# Altium project SR4K_PHY6222_v1.PrjPcb
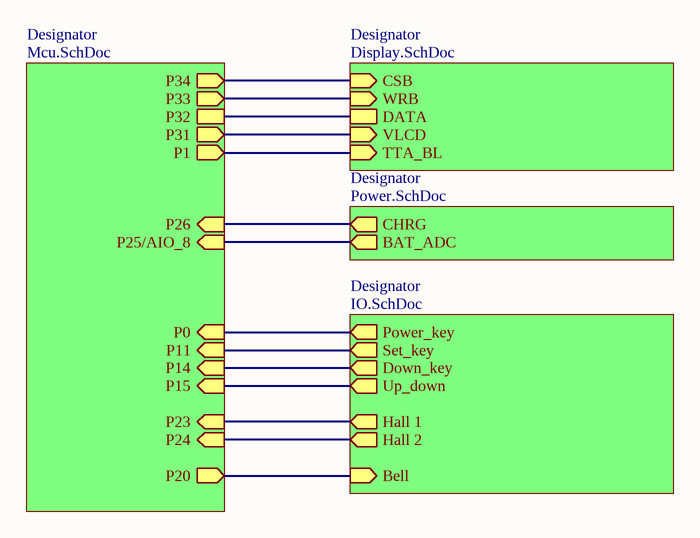
[diagram p0: Main.SchDoc]
5 sheets, 62 parts. Net scope: hierarchical (ports join the sheet entries above them; power ports are global).
Sheets:
  Main.SchDoc
    Designator = Display.SchDoc
    Designator = Power.SchDoc
    Designator = IO.SchDoc
    Designator = Mcu.SchDoc

## Sheet Main.SchDoc: SR4K_PHY6222
size A4; DrawnBy: emmovo@outlook.com; Revision: V1.2; SheetNumber: 1; SheetTotal: 5

### Sub-sheets
Designator = Display.SchDoc: CSB (in), WRB (in), DATA, VLCD (in), TTA_BL (in)
Designator = Power.SchDoc: CHRG (out), BAT_ADC (out)
Designator = IO.SchDoc: Power_key (out), Set_key (out), Down_key (out), Up_down (out), Hall 1 (out), Hall 2 (out), Bell (in)
Designator = Mcu.SchDoc: P34 (out), P33 (out), P32, P31 (out), P26 (in), P25/AIO_8 (in), P24 (in), P23 (in), P0 (in), P11 (in), P14 (in), P15 (in), P20 (out), P1 (out)

### Nets
BAT_ADC: sheet Designator/BAT_ADC, sheet Designator/P25/AIO_8
CHRG: sheet Designator/CHRG, sheet Designator/P26
NetC3_2: sheet Designator/Power_key, sheet Designator/P0
NetC4_2: sheet Designator/Set_key, sheet Designator/P11
NetC6_2: sheet Designator/Down_key, sheet Designator/P14
NetR2_2: sheet Designator/TTA_BL, sheet Designator/P1
NetR5_2: sheet Designator/Bell, sheet Designator/P20
NetTP1_0: sheet Designator/CSB, sheet Designator/P34
NetTP2_0: sheet Designator/WRB, sheet Designator/P33
NetTP3_0: sheet Designator/DATA, sheet Designator/P32
NetTP4_0: sheet Designator/VLCD, sheet Designator/P31
NetU1#2_3: sheet Designator/Hall 1, sheet Designator/P23
NetU2_3: sheet Designator/Hall 2, sheet Designator/P24
NetU3#2_15: sheet Designator/Up_down, sheet Designator/P15

### Notes on the sheet
- Title
- Size:
- Date:
- A4
- Number:
- Time:
- Revision:
- Sheet
- emmovo@outlook.com
- of
- File:

## Sheet Display.SchDoc: SR4K_PHY6222
size A4; Revision: V1.2; SheetNumber: 3; SheetTotal: 5
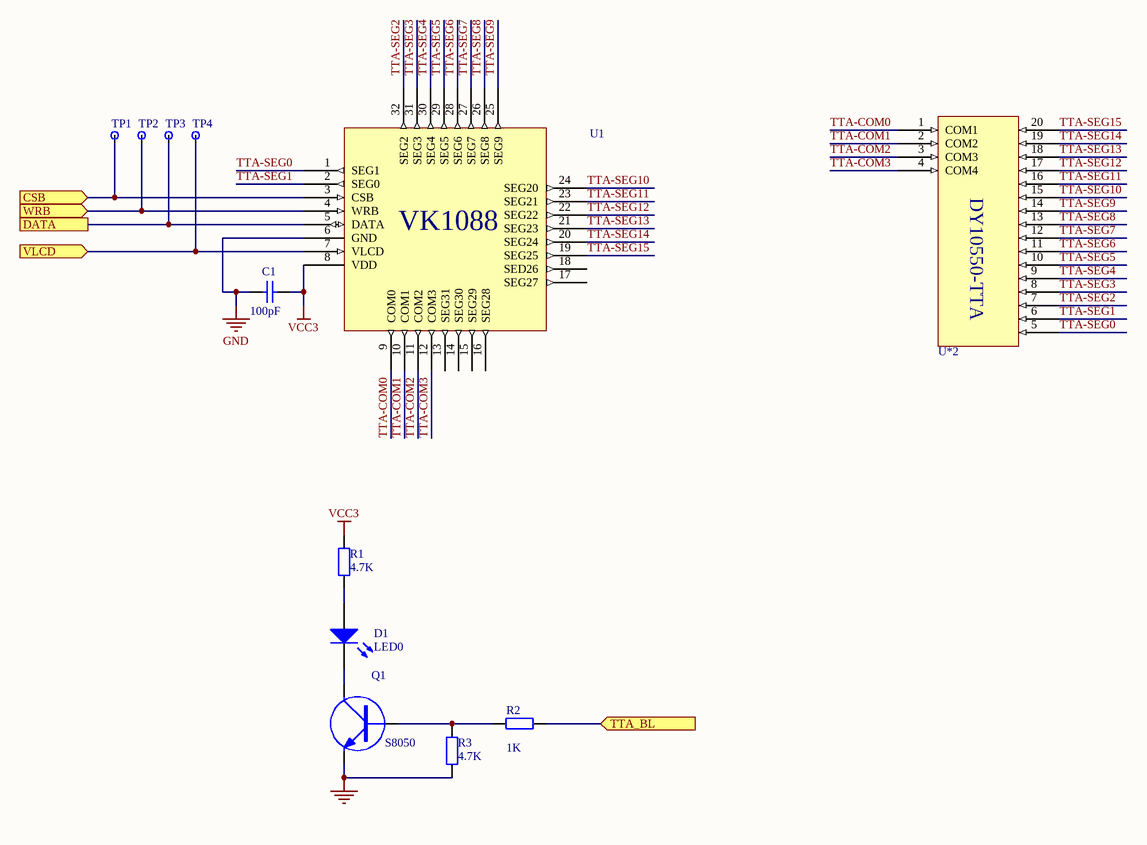
[diagram p1: Display.SchDoc]

### Parts
(Parts that share a designator on the sheet are numbered #1, #2 ... from top to bottom, then left to right.)
C1  value 100pF  [RAD-0.3]  (hidden comment: Cap)
D1  LED0
Q1  S8050
R1  value 4.7K  (hidden comment: Res2)
R2  value 1K  (hidden comment: Res2)
R3  value 4.7K  (hidden comment: 100K)
TP1  TP  (value not drawn)
TP2  TP  (value not drawn)
TP3  TP  (value not drawn)
TP4  TP  (value not drawn)
U1#1  U*  (value not drawn)
U*2  DY10550-TTA  (value not drawn)

### Ports
CSB (in), DATA, TTA_BL (in), VLCD (in), WRB (in)

### Nets
GND: C1.1 Q1.2(E) R3.1 U1#1.6(GND)
VCC3: C1.2 R1.2 U1#1.8(VDD)
TTA-COM0: U1#1.9(COM0) U*2.1(COM1)
TTA-COM1: U1#1.10(COM1) U*2.2(COM2)
TTA-COM2: U1#1.11(COM2) U*2.3(COM3)
TTA-COM3: U1#1.12(COM3) U*2.4(COM4)
TTA-SEG0: U1#1.1(SEG1) U*2.5
TTA-SEG1: U1#1.2(SEG0) U*2.6
TTA-SEG2: U1#1.32(SEG2) U*2.7
TTA-SEG3: U1#1.31(SEG3) U*2.8
TTA-SEG4: U1#1.30(SEG4) U*2.9
TTA-SEG5: U1#1.29(SEG5) U*2.10
TTA-SEG6: U1#1.28(SEG6) U*2.11
TTA-SEG7: U1#1.27(SEG7) U*2.12
TTA-SEG8: U1#1.26(SEG8) U*2.13
TTA-SEG9: U1#1.25(SEG9) U*2.14
TTA-SEG10: U1#1.24(SEG20) U*2.15
TTA-SEG11: U1#1.23(SEG21) U*2.16
TTA-SEG12: U1#1.22(SEG22) U*2.17
TTA-SEG13: U1#1.21(SEG23) U*2.18
TTA-SEG14: U1#1.20(SEG24) U*2.19
TTA-SEG15: U1#1.19(SEG25) U*2.20
NetD1_1: D1.1(A) R1.1
NetD1_2: D1.2(K) Q1.3(C)
NetQ1_1: Q1.1(B) R2.1 R3.2
NetR2_2: R2.2 ; port TTA_BL
NetTP1_0: TP1.0 U1#1.3(CSB) ; port CSB
NetTP2_0: TP2.0 U1#1.4(WRB) ; port WRB
NetTP3_0: TP3.0 U1#1.5(DATA) ; port DATA
NetTP4_0: TP4.0 U1#1.7(VLCD) ; port VLCD

Not connected (* = marked no-connect by the designer): U1#1 13(SEG31) 14(SEG30) 15(SEG29) 16(SEG28) 17(SEG27) 18(SED26)

### Notes on the sheet
- Title
- Size:
- Date:
- A4
- Number:
- Time:
- Revision:
- Sheet
- emmovo@outlook.com
- of
- File:

### Library data of the parts
C1 = Cap: Capacitor; Published: 8-Jun-2000; LatestRevisionDate: 17-Jul-2002; LatestRevisionNote: Re-released for DXP Platform.; PackageReference: RAD-0.3; Publisher: Altium Limited; PackageDescription: Radial Cap, Thru-Hole; 2 Leads; 0.3 in Pin Spacing
D1 = LED0: Typical INFRARED GaAs LED; Published: 8-Jun-2000; LatestRevisionDate: 08-Jul-2005; LatestRevisionNote: Mech Layer 1 removed.; PackageReference: LED-0; Publisher: Altium Limited; PackageDescription: LED; 2 Leads
Q1 = NPN: NPN Transistor
R1-R3 = Res2: Resistor; Published: 8-Jun-2000; LatestRevisionDate: 17-Jul-2002; LatestRevisionNote: Re-released for DXP Platform.; PackageReference: AXIAL-0.4; Publisher: Altium Limited; PackageDescription: Axial Device, Thru-Hole; 2 Leads; 0.4 in Pin Spacing
U1#1 = VK1088

## Sheet Power.SchDoc: SR4K_PHY6222
size A4; Revision: V1.2; SheetNumber: 4; SheetTotal: 5
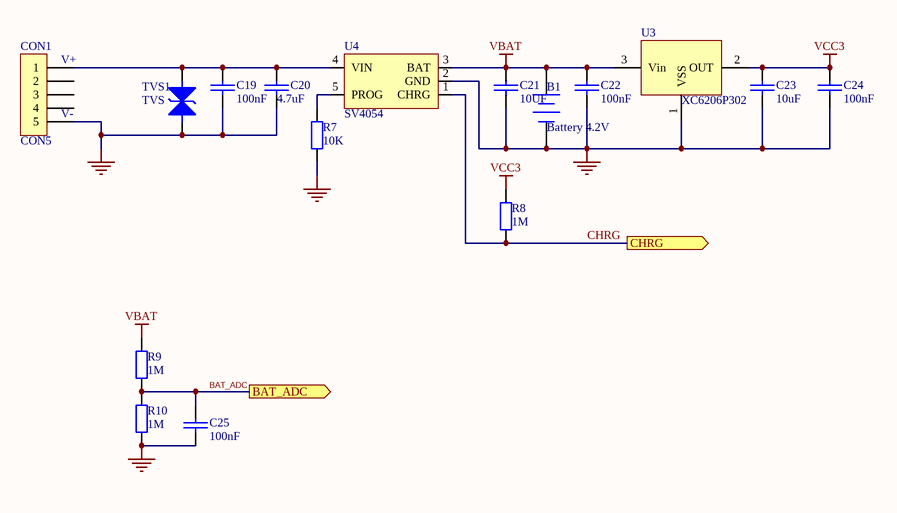
[diagram p2: Power.SchDoc]

### Parts
(Parts that share a designator on the sheet are numbered #1, #2 ... from top to bottom, then left to right.)
B1  Battery 4.2V  [JP2S]
C19  100nF  [0603]
C20  4.7uF  [0603]
C21  10UF  [0603]
C22  100nF  [0603]
C23  10uF  [0603]
C24  100nF  [0603]
C25  100nF
CON1  CON5
R7  10K  [AXIAL-0.4]
R8  1M
R9  1M
R10  1M
TVS1  TVS  [SOD-123]
U3#1  XC6206P302  [SOT-23]
U4  SV4054  [SOT-25]

### Ports
BAT_ADC (out), CHRG (out)

### Nets
GND: B1.2(-) C19.1 C20.1 C21.1 C22.1 C23.1 C24.1 C25.1 CON1.5 R7.1 R10.1 TVS1.1 U3#1.1(VSS) U4.2(GND)
VBAT: B1.1(+) C21.2 C22.2 R9.2 U3#1.3(Vin) U4.3(BAT)
VCC3: C23.2 C24.2 R8.2 U3#1.2(OUT)
BAT_ADC: C25.2 R9.1 R10.2 ; port BAT_ADC
CHRG: R8.1 U4.1(CHRG) ; port CHRG
NetC19_2: C19.2 C20.2 CON1.1 TVS1.2 U4.4(VIN)
NetR7_2: R7.2 U4.5(PROG)

Not connected (* = marked no-connect by the designer): CON1 2 3 4

### Notes on the sheet
- (near CON1) V+
- (near CON1) V-
- Title
- Size:
- Date:
- A4
- Number:
- Time:
- Revision:
- Sheet
- emmovo@outlook.com
- of
- File:

### Library data of the parts
B1 = Battery: Multicell Battery; Published: 24-Mar-1999; LatestRevisionDate: 17-Jul-2002; LatestRevisionNote: Re-released for DXP Platform.; PackageReference: BAT-2; Publisher: Altium Limited; PackageDescription: Battery; 2 Leads
C19-C25 = CAP: Capacitor
CON1 = CON5: Connector
R7 = Res2: 1%@100mA; Published: 8-Jun-2000; LatestRevisionDate: 17-Jul-2002; LatestRevisionNote: Re-released for DXP Platform.; PackageReference: AXIAL-0.4; Publisher: Altium Limited; PackageDescription: Axial Device, Thru-Hole; 2 Leads; 0.4 in Pin Spacing; Value: 10K
R8-R10 = Res2: Published: 8-Jun-2000; LatestRevisionDate: 17-Jul-2002; LatestRevisionNote: Re-released for DXP Platform.; PackageReference: AXIAL-0.4; Publisher: Altium Limited; PackageDescription: Axial Device, Thru-Hole; 2 Leads; 0.4 in Pin Spacing; Value: 1M

## Sheet IO.SchDoc: SR4K_PHY6222
size A4; Revision: V1.2; SheetNumber: 5; SheetTotal: 5
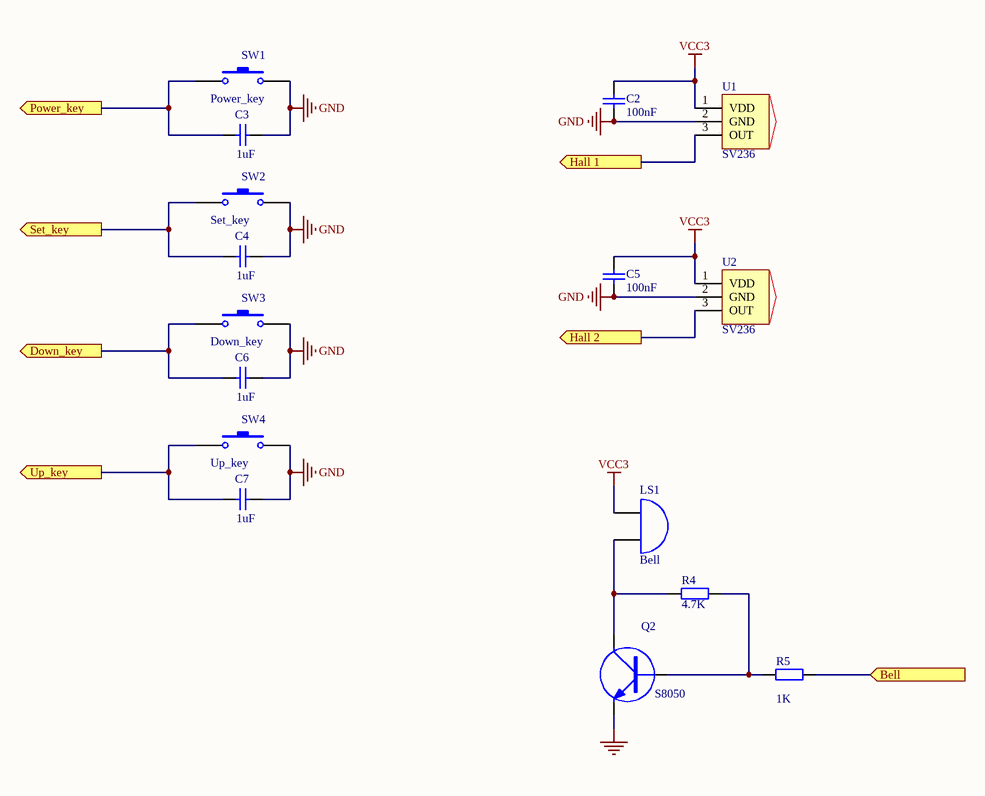
[diagram p3: IO.SchDoc]

### Parts
(Parts that share a designator on the sheet are numbered #1, #2 ... from top to bottom, then left to right.)
C2  value 100nF  [RAD-0.3]  (hidden comment: Cap)
C3  value 1uF  (hidden comment: Cap)
C4  value 1uF  (hidden comment: Cap)
C5  value 100nF  [RAD-0.3]  (hidden comment: Cap)
C6  value 1uF  (hidden comment: Cap)
C7  value 1uF  (hidden comment: Cap)
LS1  Bell
Q2  S8050  [SOT-23]
R4  value 4.7K  (hidden comment: 100K)
R5  value 1K  (hidden comment: Res2)
SW1  Power_key
SW2  Set_key
SW3  Down_key
SW4  Up_key
U1#2  SV236  [sot-23-3]
U2  SV236  [sot-23-3]

### Ports
Bell (in), Down_key (out), Hall 1 (out), Hall 2 (out), Power_key (out), Set_key (out), Up_key (out)

### Nets
GND: C2.2 C3.1 C4.1 C5.2 C6.1 C7.1 Q2.2(E) SW1.2 SW2.2 SW3.2 SW4.2 U1#2.2(GND) U2.2(GND)
VCC3: C2.1 C5.1 LS1.1(A) U1#2.1(VDD) U2.1(VDD)
NetC3_2: C3.2 SW1.1 ; port Power_key
NetC4_2: C4.2 SW2.1 ; port Set_key
NetC6_2: C6.2 SW3.1 ; port Down_key
NetC7_2: C7.2 SW4.1 ; port Up_key
NetLS1_2: LS1.2(B) Q2.3(C) R4.2
NetQ2_1: Q2.1(B) R4.1 R5.1
NetR5_2: R5.2 ; port Bell
NetU1#2_3: U1#2.3(OUT) ; port Hall 1
NetU2_3: U2.3(OUT) ; port Hall 2

### Notes on the sheet
- Title
- Size:
- Date:
- A4
- Number:
- Time:
- Revision:
- Sheet
- emmovo@outlook.com
- of
- File:

### Library data of the parts
C2-C7 = Cap: Capacitor; Published: 8-Jun-2000; LatestRevisionDate: 17-Jul-2002; LatestRevisionNote: Re-released for DXP Platform.; PackageReference: RAD-0.3; Publisher: Altium Limited; PackageDescription: Radial Cap, Thru-Hole; 2 Leads; 0.3 in Pin Spacing
LS1 = Bell: Electrical Bell; Published: 24-Mar-1999; LatestRevisionDate: 17-Jul-2002; LatestRevisionNote: Re-released for DXP Platform.; PackageReference: PIN2; Publisher: Altium Limited
Q2 = NPN: NPN Transistor
R4 R5 = Res2: Resistor; Published: 8-Jun-2000; LatestRevisionDate: 17-Jul-2002; LatestRevisionNote: Re-released for DXP Platform.; PackageReference: AXIAL-0.4; Publisher: Altium Limited; PackageDescription: Axial Device, Thru-Hole; 2 Leads; 0.4 in Pin Spacing
SW1-SW4 = SW-PB: Switch; Published: 24-Mar-1999; LatestRevisionDate: 17-Jul-2002; LatestRevisionNote: Re-released for DXP Platform.; PackageReference: SPST-2; Publisher: Altium Limited
U1#2 U2 = 霍尔44E 938

## Sheet Mcu.SchDoc: SR4K_PHY6222
size A4; Revision: V1.2; SheetNumber: 2; SheetTotal: 5
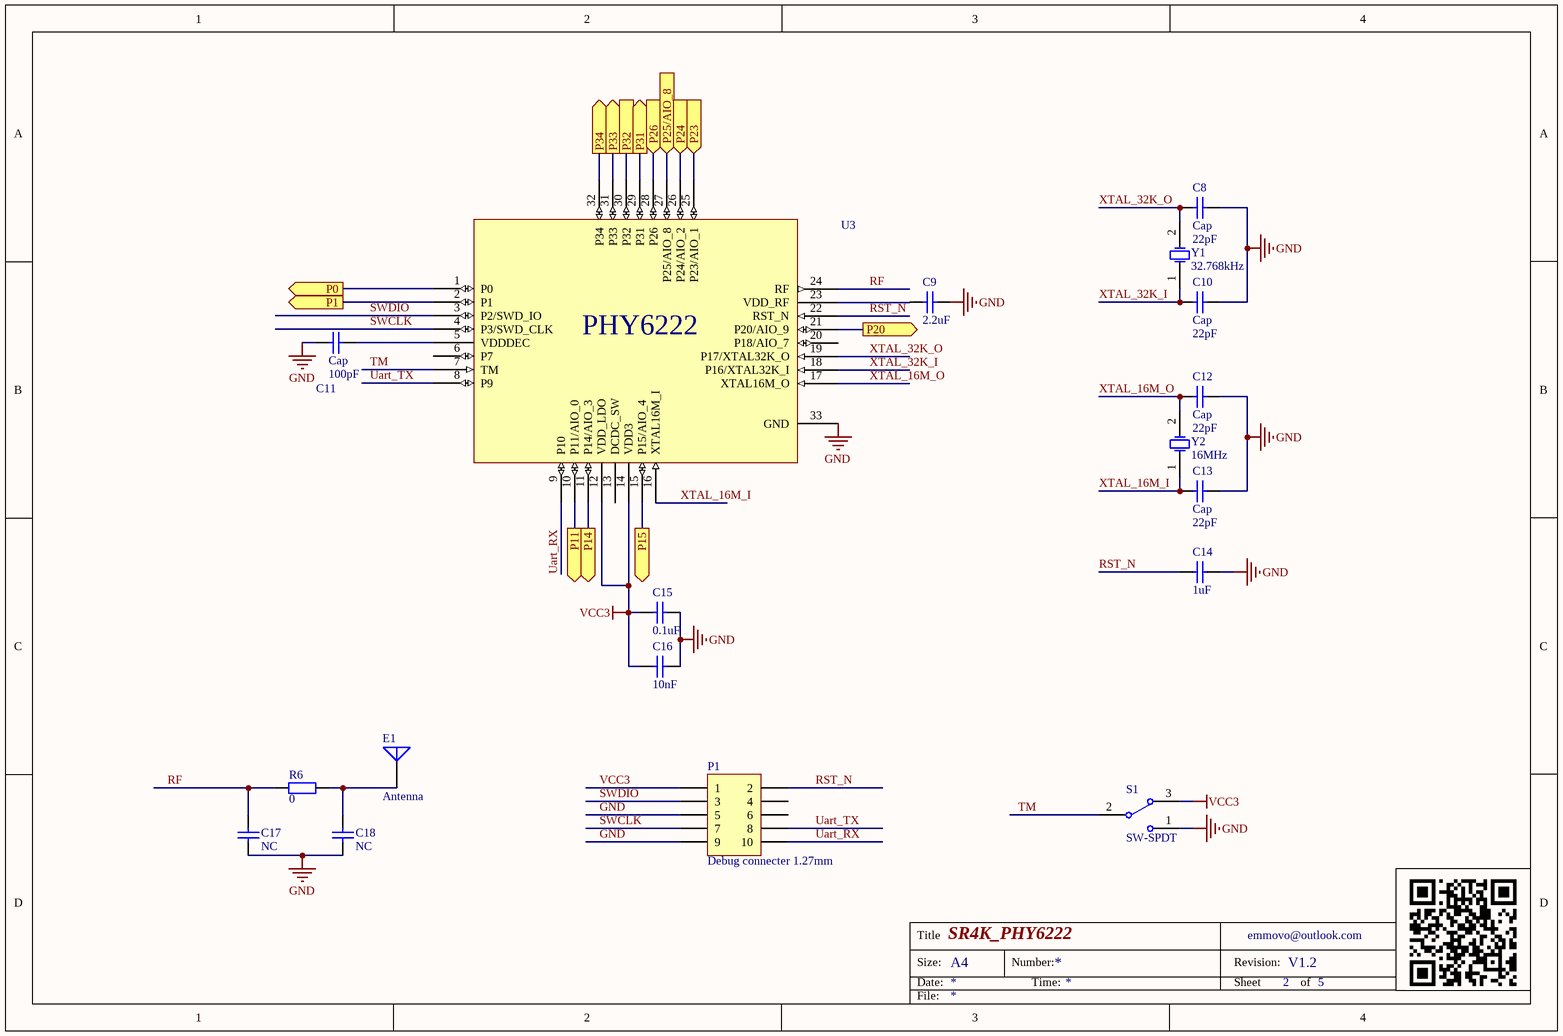
[diagram p4: Mcu.SchDoc]

### Parts
(Parts that share a designator on the sheet are numbered #1, #2 ... from top to bottom, then left to right.)
C8  Cap  value 22pF
C9  value 2.2uF  (hidden comment: Cap)
C10  Cap  value 22pF
C11  Cap  value 100pF
C12  Cap  value 22pF
C13  Cap  value 22pF
C14  value 1uF  (hidden comment: Cap)
C15  value 0.1uF  (hidden comment: Cap)
C16  value 10nF  (hidden comment: Cap)
C17  value NC  (hidden comment: Cap)
C18  value NC  (hidden comment: Cap)
E1  Antenna  [PIN1]
P1  Debug connecter 1.27mm
R6  0
S1  SW-SPDT
U3#2  U*  (value not drawn)
Y1  32.768kHz
Y2  16MHz

### Ports
P0 (out), P1 (out), P11 (out), P14 (out), P15 (out), P20 (out), P23 (in), P24 (in), P25/AIO_8 (in), P26 (in), P31 (out), P32, P33 (out), P34 (out)

### Nets
GND: C8.1 C9.2 C10.1 C11.1 C12.1 C13.1 C14.2 C15.2 C16.2 C17.2 C18.2 P1.5 P1.9 S1.1 U3#2.33(GND)
VCC3: P1.1 S1.3
BAT_ADC: U3#2.27(P25/AIO_8) ; port P25/AIO_8
CHRG: U3#2.28(P26) ; port P26
RF: C17.1 R6.2 U3#2.24(RF)
RST_N: C14.1 P1.2 U3#2.22(RST_N)
SWCLK: P1.7 U3#2.4(P3/SWD_CLK)
SWDIO: P1.3 U3#2.3(P2/SWD_IO)
TM: S1.2 U3#2.7(TM)
Uart_RX: P1.10 U3#2.9(P10)
Uart_TX: P1.8 U3#2.8(P9)
XTAL_16M_I: C13.2 U3#2.16(XTAL16M_I) Y2.1(OSC1)
XTAL_16M_O: C12.2 U3#2.17(XTAL16M_O) Y2.2(OSC2)
XTAL_32K_I: C10.2 U3#2.18(P16/XTAL32K_I) Y1.1(OSC1)
XTAL_32K_O: C8.2 U3#2.19(P17/XTAL32K_O) Y1.2(OSC2)
NetC3_2: U3#2.1(P0) ; port P0
NetC4_2: U3#2.10(P11/AIO_0) ; port P11
NetC6_2: U3#2.11(P14/AIO_3) ; port P14
NetC9_1: C9.1 U3#2.23(VDD_RF)
NetC11_2: C11.2 U3#2.5(VDDDEC)
NetC15_1: C15.1 C16.1 U3#2.12(VDD_LDO) U3#2.14(VDD3)
NetC18_1: C18.1 E1.1(A) R6.1
NetR2_2: U3#2.2(P1) ; port P1
NetR5_2: U3#2.21(P20/AIO_9) ; port P20
NetTP1_0: U3#2.32(P34) ; port P34
NetTP2_0: U3#2.31(P33) ; port P33
NetTP3_0: U3#2.30(P32) ; port P32
NetTP4_0: U3#2.29(P31) ; port P31
NetU1#2_3: U3#2.25(P23/AIO_1) ; port P23
NetU2_3: U3#2.26(P24/AIO_2) ; port P24
NetU3#2_15: U3#2.15(P15/AIO_4) ; port P15

Not connected (* = marked no-connect by the designer): P1 4 6; U3#2 6(P7) 13(DCDC_SW) 20(P18/AIO_7)

### Notes on the sheet
- Labels drawn without touching a wire or pin: VCC3
- Title
- Size:
- Date:
- A4
- Number:
- Time:
- Revision:
- Sheet
- emmovo@outlook.com
- of
- File:

### Library data of the parts
C8-C18 = Cap: Capacitor; Published: 8-Jun-2000; LatestRevisionDate: 17-Jul-2002; LatestRevisionNote: Re-released for DXP Platform.; PackageReference: RAD-0.3; Publisher: Altium Limited; PackageDescription: Radial Cap, Thru-Hole; 2 Leads; 0.3 in Pin Spacing
E1 = Antenna: Generic Antenna; Published: 24-Mar-1999; LatestRevisionDate: 17-Jul-2002; LatestRevisionNote: Re-released for DXP Platform.; PackageReference: PIN1; Publisher: Altium Limited
P1 = Header 5X2: Header, 5-Pin, Dual row; LatestRevisionDate: 17-Jul-2002; LatestRevisionNote: Re-released for DXP Platform.; Publisher: Altium Limited
R6 = Res2: Resistor; Published: 8-Jun-2000; LatestRevisionDate: 17-Jul-2002; LatestRevisionNote: Re-released for DXP Platform.; PackageReference: AXIAL-0.4; Publisher: Altium Limited; PackageDescription: Axial Device, Thru-Hole; 2 Leads; 0.4 in Pin Spacing; Value: 0
S1 = SW-SPDT: SPDT Subminiature Toggle Switch, Right Angle Mounting, Vertical Actuation; Published: 24-Mar-1999; LatestRevisionDate: 17-Dec-2003; LatestRevisionNote: Schematic revised, PCB Footprint replaced.; DatasheetVersion: 05-Dec-2000; PackageReference: TL36WW15050; Publisher: Altium Limited; PackageDescription: Switch; 4 Leads; ComponentLink1Description: Manufacturer Link; ComponentLink1URL: http://www.apem.com
U3#2 = PHY6222
Y1 Y2 = XTAL: Crystal Oscillator; Published: 8-Jun-2000; LatestRevisionDate: 17-Jul-2002; LatestRevisionNote: Re-released for DXP Platform.; PackageReference: R38; Publisher: Altium Limited; PackageDescription: Crystal, Thru-Hole; 2 Leads; Body 3.1 x 8.2 mm (Dia.xH)

## Nets that join several sheets
GND: Display (C1.1 Q1.2 R3.1 U1#1.6), Power (14 pins), IO (13 pins), Mcu (15 pins)
VCC3: Display (C1.2 R1.2 U1#1.8), Power (C23.2 C24.2 R8.2 U3#1.2), IO (5 pins), Mcu (P1.1 S1.3)
BAT_ADC: Power (C25.2 R9.1 R10.2), Mcu (U3#2.27)
CHRG: Power (R8.1 U4.1), Mcu (U3#2.28)
NetC3_2: IO (C3.2 SW1.1), Mcu (U3#2.1)
NetC4_2: IO (C4.2 SW2.1), Mcu (U3#2.10)
NetC6_2: IO (C6.2 SW3.1), Mcu (U3#2.11)
NetR2_2: Display (R2.2), Mcu (U3#2.2)
NetR5_2: IO (R5.2), Mcu (U3#2.21)
NetTP1_0: Display (TP1.0 U1#1.3), Mcu (U3#2.32)
NetTP2_0: Display (TP2.0 U1#1.4), Mcu (U3#2.31)
NetTP3_0: Display (TP3.0 U1#1.5), Mcu (U3#2.30)
NetTP4_0: Display (TP4.0 U1#1.7), Mcu (U3#2.29)
NetU1#2_3: IO (U1#2.3), Mcu (U3#2.25)
NetU2_3: IO (U2.3), Mcu (U3#2.26)